# EAGLE design 234_sync_clock_divider (EAGLE 7.5.0)
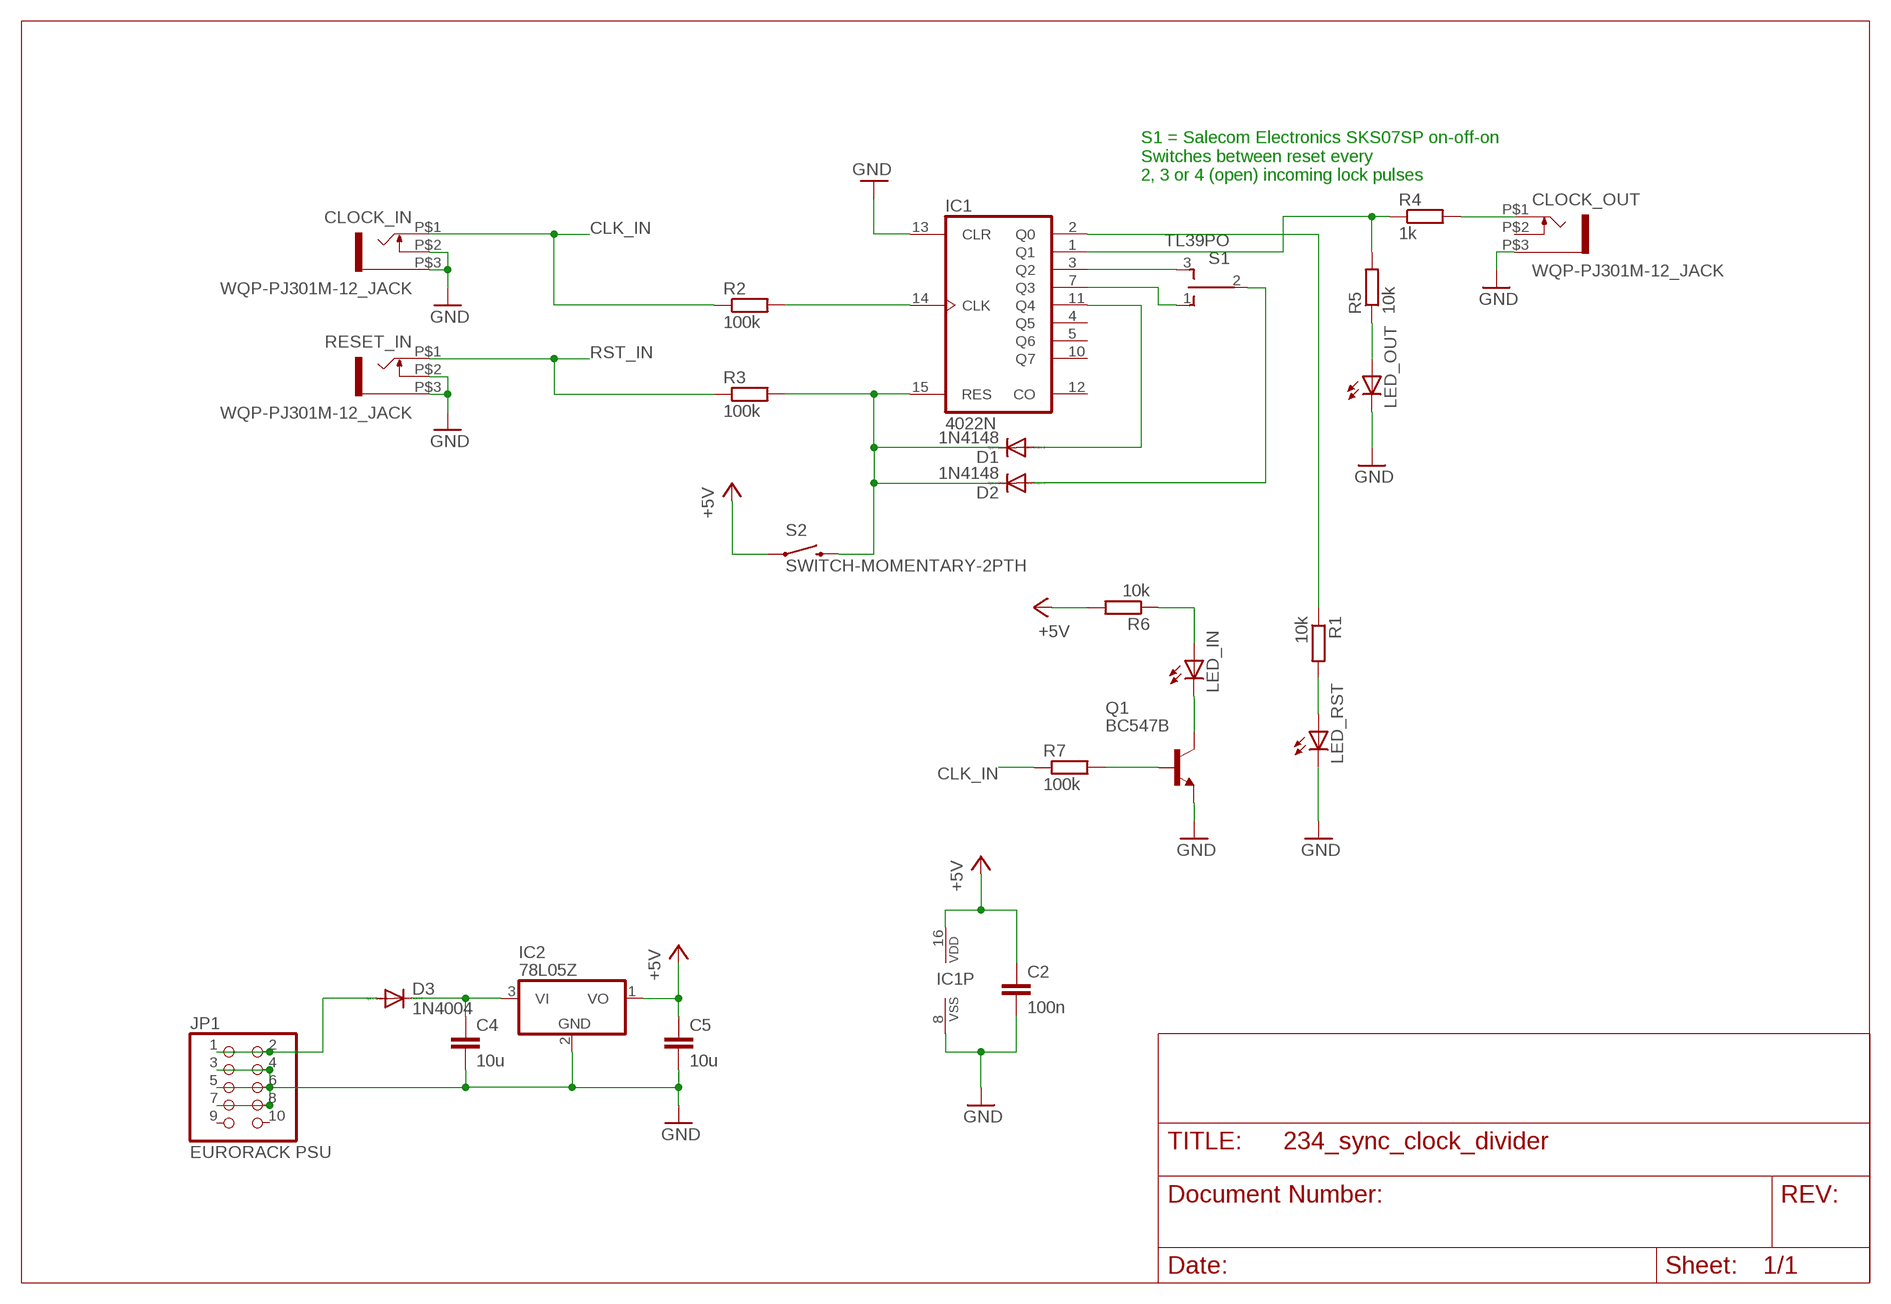
[diagram p0: schematic, sheet 1]

## Parts
C2  100n  C-EU025-025X050  [C025-025X050]
C4  10u  C-EUC1206K  [C1206K]
C5  10u  C-EUC1206K  [C1206K]
CLOCK_IN  WQP-PJ301M-12_JACK  [WQP-PJ301M-12_JACK]
CLOCK_OUT  WQP-PJ301M-12_JACK  [WQP-PJ301M-12_JACK]
D1  1N4148  DIODE-D-2.5  [D-2.5]
D2  1N4148  DIODE-D-2.5  [D-2.5]
D3  1N4004  DIODE-D-2.5  [D-2.5]
IC1  4022N  [DIL16]
IC2  78L05Z  [TO92]
JP1  EURORACK PSU  PINHD-2X5  [2X05]
LED_IN  LED3MM  [LED3MM]
LED_OUT  LED3MM  [LED3MM]
LED_RST  LED3MM  [LED3MM]
Q1  BC547B  [TO92]
R1  10k  R-EU_0204/2V  [0204V]
R2  100k  R-EU_0204/2V  [0204V]
R3  100k  R-EU_0204/2V  [0204V]
R4  1k  R-EU_0204/2V  [0204V]
R5  10k  R-EU_0204/2V  [0204V]
R6  10k  R-EU_0204/2V  [0204V]
R7  100k  R-EU_0204/2V  [0204V]
RESET_IN  WQP-PJ301M-12_JACK  [WQP-PJ301M-12_JACK]
S1  TL39PO  [TL3XPO]
S2  SWITCH-MOMENTARY-2PTH  [TACTILE-PTH]

## Nets
+5V: C2.1 C5.1 IC1.16(VDD) IC2.1(VO) R6.2 S2.1
+12V_IN: D3.A JP1.1 JP1.2
CLK_IN: CLOCK_IN.P$1 R2.1 R7.1
GND: C2.2 C4.2 C5.2 CLOCK_IN.P$2 CLOCK_IN.P$3 CLOCK_OUT.P$3 IC1.8(VSS) IC1.13(CLR) IC2.2(GND) JP1.3 JP1.4 JP1.5 JP1.6 JP1.7 JP1.8 LED_OUT.K(C) LED_RST.K(C) Q1.1(E) RESET_IN.P$2 RESET_IN.P$3
N$1: LED_RST.A R1.2
N$2: IC1.14(CLK) R2.2
N$3: D1.C D2.C IC1.15(RES) R3.2 S2.3
N$4: IC1.2(Q0) R1.1
N$7: IC1.1(Q1) R4.1 R5.2
N$8: CLOCK_OUT.P$1 R4.2
N$9: LED_OUT.A R5.1
N$10: D1.A IC1.11(Q4)
N$11: IC1.3(Q2) S1.3(S)
N$12: IC1.7(Q3) S1.1(O)
N$13: D2.A S1.2(P)
N$14: C4.1 D3.C IC2.3(VI)
N$16: LED_IN.A R6.1
N$17: LED_IN.K(C) Q1.3(C)
N$18: Q1.2(B) R7.2
RST_IN: R3.1 RESET_IN.P$1
Unconnected: CLOCK_OUT.P$2 IC1.4(Q5) IC1.5(Q6) IC1.10(Q7) IC1.12(CO) JP1.9 JP1.10

## Notes on the sheet
- S1 = Salecom Electronics SKS07SP on-off-on
  Switches between reset every
  2, 3 or 4 (open) incoming lock pulses

## Library data of the parts
C2 C4 C5 = rcl:C-EU: CAPACITOR, European symbol
CLOCK_IN CLOCK_OUT RESET_IN = thonkiconn:WQP-PJ301M-12_JACK
D1-D3 = diode:DIODE-: DIODE
IC1 = 40xx:4022: Divide-by 8 COUNTER
IC2 = linear:78*: Positive VOLTAGE REGULATOR Source: http://cache.national.com/ds/LM/LM78L05.pdf http://www.fairchildsemi.com/ds/LM/LM7805.pdf
JP1 = pinhead:PINHD-2X5: PIN HEADER
LED_IN LED_OUT LED_RST = led:LED: LED OSRAM: - CHIPLED LG R971, LG N971, LY N971, LG Q971, LY Q971, LO R971, LY R971 LH N974, LH R974 LS Q976, LO Q976, LY Q976 LO Q996 - Hyper CHIPLED LW Q18S LB Q993, LB Q99A, LB R99A - SideLED LS A670, LO A670, LY A670, LG A670, LP A670 LB A673, LV A673, LT A673, LW A673 LH A674 LY A675 LS A676, LA A676, LO A676, LY A676, LW A676 LS A679, LY A679, LG A679 - Hyper Micro SIDELED® LS Y876, LA Y876, LO Y876, LY Y876 LT Y87S - SmartLED LW L88C, LW L88S LB L89C, LB L89S, LG L890 LS L89K, LO L89K, LY L89K LS L896, LA L896, LO L896, LY L896 - TOPLED LS T670, LO T670, LY T670, LG T670, LP T670 LSG T670, LSP T670, LSY T670, LOP T670, LYG T670 LG T671, LOG T671, LSG T671 LB T673, LV T673, LT T673, LW T673 LH T674 LS T676, LA T676, LO T676, LY T676, LB T676, LH T676, LSB T676, LW T676 LB T67C, LV T67C, LT T67C, LS T67K, LO T67K, LY T67K, LW E67C LS E67B, LA E67B, LO E67B, LY E67B, LB E67C, LV E67C, LT E67C LW T67C LS T679, LY T679, LG T679 LS T770, LO T770, LY T770, LG T770, LP T770 LB T773, LV T773, LT T773, LW T773 LH T774 LS E675, LA E675, LY E675, LS T675 LS T776, LA T776, LO T776, LY T776, LB T776 LHGB T686 LT T68C, LB T68C - Hyper Mini TOPLED® LB M676 - Mini TOPLED Santana® LG M470 LS M47K, LO M47K, LY M47K Source: http://www.osram.convergy.de LUXEON: - LUMILED® LXK2-PW12-R00, LXK2-PW12-S00, LXK2-PW14-U00, LXK2-PW14-V00 LXK2-PM12-R00, LXK2-PM12-S00, LXK2-PM14-U00 LXK2-PE12-Q00, LXK2-PE12-R00, LXK2-PE12-S00, LXK2-PE14-T00, LXK2-PE14-U00 LXK2-PB12-K00, LXK2-PB12-L00, LXK2-PB12-M00, LXK2-PB14-N00, LXK2-PB14-P00, LXK2-PB14-Q00 LXK2-PR12-L00, LXK2-PR12-M00, LXK2-PR14-Q00, LXK2-PR14-R00 LXK2-PD12-Q00, LXK2-PD12-R00, LXK2-PD12-S00 LXK2-PH12-R00, LXK2-PH12-S00 LXK2-PL12-P00, LXK2-PL12-Q00, LXK2-PL12-R00 Source: www.luxeon.com KINGBRIGHT: KA-3528ASYC Source: www.kingbright.com
Q1 = transistor-npn:BC547*: NPN Transistor
R1-R7 = rcl:R-EU_: RESISTOR, European symbol
S1 = switch:TL39PO: TINY SWITCH ON OFF ON Source: http://www2.produktinfo.conrad.com/datenblaetter/700000-724999/705152-da-01-de-Subminiaturschalter_TL_36YO.pdf
S2 = SparkFun-Electromechanical:SWITCH-MOMENTARY-2: Various NO switches- pushbuttons, reed, etc; PROD_ID: SWCH-08441

## Board
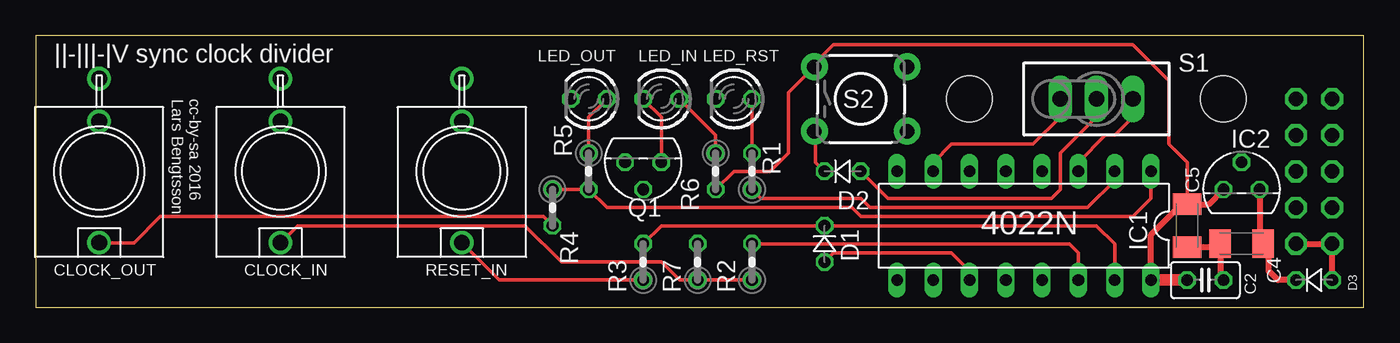
[diagram p1: board, top side]
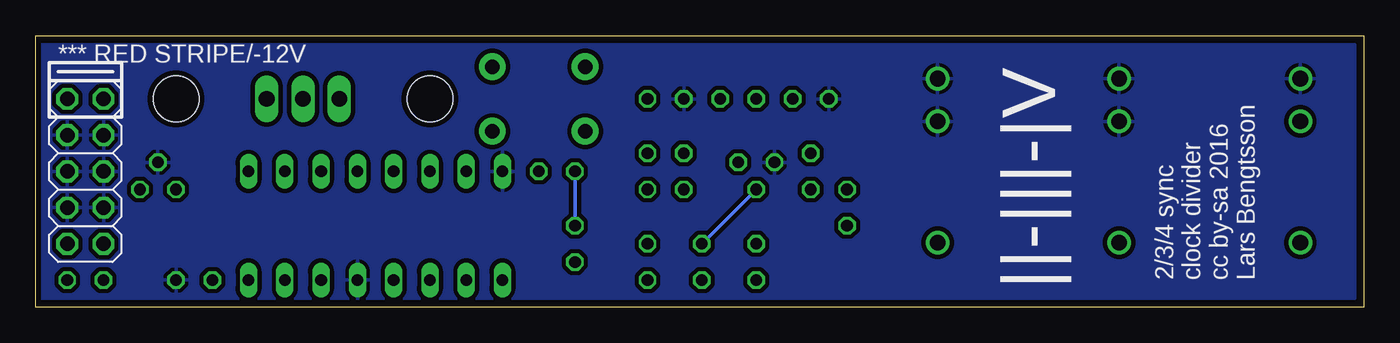
[diagram p2: board, bottom side, seen from below]

Size 93.02 x 19.04 mm. Coordinates in mm from the lower left corner, seen from the top.
Outline: 0,0 93.02,0 93.02,19.04 0,19.04 0,0
Copper layers (1*16): Top 0.0356mm / dielectric 1.5011mm / Bottom 0.0356mm
Design rules "LaenPCBOrder": minimum track width 6mil, minimum drill 13mil, track to track 6mil, track to pad 6mil, pad to pad 6mil, via to via 6mil, smd to smd 6mil, copper to edge 15mil, drill to drill 6mil, minimum pad ring 7mil, minimum via ring 7mil, stop-mask expansion 3mil, vias tented up to drill 0mil, thermal gap 10mil
Holes 3.2 mm at 65.41,14.61 83.19,14.61

### Footprints (pad centres in the part's own frame; a part is rotated, then mirrored left to right if it is on the bottom)
C025-025X050 = drill 0.813 octagon: 1 -1.27,0; 2 1.27,0
C1206K = smd 1.5 x 2: 1 -1.5,0; 2 1.5,0
WQP-PJ301M-12_JACK = drill 1.1: P$1 0,5; P$2 0,-3.5; P$3 0,-6.5
D-2.5 = drill 0.813 octagon: A 1.27,0; C -1.27,0
DIL16 = drill 0.813 long: 1 -8.89,-3.81; 2 -6.35,-3.81; 3 -3.81,-3.81; 4 -1.27,-3.81; 5 1.27,-3.81; 6 3.81,-3.81; 7 6.35,-3.81; 8 8.89,-3.81; 9 8.89,3.81; 10 6.35,3.81; 11 3.81,3.81; 12 1.27,3.81; 13 -1.27,3.81; 14 -3.81,3.81; 15 -6.35,3.81; 16 -8.89,3.81
TO92 = drill 0.813 octagon: 1 -1.27,0; 2 0,1.905; 3 1.27,0
2X05 = drill 1.016 octagon: 1 -5.08,-1.27; 2 -5.08,1.27; 3 -2.54,-1.27; 4 -2.54,1.27; 5 0,-1.27; 6 0,1.27; 7 2.54,-1.27; 8 2.54,1.27; 9 5.08,-1.27; 10 5.08,1.27
LED3MM = drill 0.813 octagon: A -1.27,0; K 1.27,0
TO92' = drill 0.813 octagon: 1 1.27,0; 2 0,1.905; 3 -1.27,0
0204V = drill 0.813 octagon: 1 -1.27,0; 2 1.27,0
TL3XPO = drill 1.1 pad 1.422 long: 1 -2.54,0; 2 0,0; 3 2.54,0
TACTILE-PTH = drill 1.016 pad 1.88: 1 -3.251,2.261; 2 3.251,2.261; 3 -3.251,-2.261; 4 3.251,-2.261

### Placement (x,y rotation side)
C2  81.92,1.91 0 top
C4  84.45,4.45 180 top
C5  80.64,5.72 270 top
CLOCK_IN  17.14,9.53 180 top
CLOCK_OUT  4.45,9.53 180 top
D1  55.25,4.45 270 top
D2  56.52,9.53 0 top
D3  89.53,1.91 0 top
IC1  69.22,5.72 180 top
IC2  84.45,8.26 0 top
JP1  89.53,9.53 90 bottom
LED_IN  43.82,14.61 180 top
LED_OUT  38.73,14.61 180 top
LED_RST  48.9,14.61 180 top
Q1  BC547B  [TO92']  42.55,10.16 180 top
R1  50.17,9.53 90 top
R2  50.17,3.18 90 top
R3  42.55,3.18 90 top
R4  36.2,6.99 270 top
R5  38.73,9.53 270 top
R6  47.62,9.53 270 top
R7  46.36,3.18 90 top
RESET_IN  29.85,9.53 180 top
S1  74.3,14.61 0 top
S2  57.79,14.61 0 top

### Tracks (layer width: path | path; a pad name or v marks a point on that pad's centre or on a via)
+5V
  Top 0.254: R6.2 48.9,9.53 51.44,9.53 52.71,10.8 52.71,15.04 S2.1 54.53,17.07 55.88,18.41 76.84,18.41 79.38,15.88 79.38,11.43 80.64,10.16 C5.1 80.64,6.99
  Top 0.406: C5.1 82.14,7.22 IC2.1 | IC1.16 78.11,5.08 80.01,6.99 80.64,6.99
  Top 0.813: IC1.16 C2.1
+12V_IN
  Top 0.406: JP1.1 JP1.2 D3.A
CLK_IN
  Top 0.254: CLOCK_IN.P$1 18.34,5.72 34.29,5.72 36.83,3.18 43.82,3.18 45.09,1.91 R7.1 R2.1
GND
  Top 0.406: C5.2 82.73,4.22 C4.2 82.95,2.14 C2.2
  pour Bottom (isolate 0.305): 0.64,18.41 92.71,18.41 92.71,0.64 0.64,0.64
N$1
  Top 0.254: LED_RST.A R1.2
N$2
  Top 0.254: IC1.14 73.03,3.81 72.39,4.45 R2.2
N$3
  Top 0.254: IC1.15 75.56,4.45 74.3,5.72 D1.C 43.82,5.72 R3.2 | D2.C 54.61,10.16 54.61,12.27 S2.3
  Bottom 0.254: D2.C D1.C
N$4
  Top 0.254: IC1.2 75.56,8.89 73.66,6.99 58.42,6.99 57.79,7.62 50.8,7.62 R1.1
N$7
  Top 0.254: R4.1 R5.2 40.01,6.99 57.15,6.99 57.79,6.35 76.84,6.35 78.11,7.62 IC1.1
N$8
  Top 0.254: CLOCK_OUT.P$1 6.91,4.53 8.73,6.35 35.56,6.35 R4.2
N$9
  Top 0.254: R5.1 38.73,13.34 LED_OUT.A
N$10
  Top 0.254: IC1.11 65.41,2.54 64.14,3.81 55.88,3.81 D1.A
N$11
  Top 0.254: S1.3 76.84,13.34 75.56,12.07 74.93,12.07 73.03,10.16 IC1.3
N$12
  Top 0.254: S1.1 71.76,13.34 69.85,11.43 64.14,11.43 62.87,10.16 IC1.7
N$13
  Top 0.254: S1.2 74.3,13.34 71.76,10.8 71.76,8.26 71.12,7.62 59.69,7.62 D2.A
N$14
  Top 0.406: D3.C 87,1.91 86.36,2.54 86.36,4.04 C4.1 85.73,4.68 IC2.3
N$16
  Top 0.254: R6.1 47.62,12.07 LED_IN.A
N$17
  Top 0.254: Q1.3 43.82,13.34 LED_IN.K
N$18
  Bottom 0.254: R7.2 Q1.2
RST_IN
  Top 0.254: RESET_IN.P$1 32.47,1.91 R3.1

### Text on the board
tPlace: ||-|||-|V sync clock divider | cc-by-sa 2016 / Lars Bengtsson
bPlace: *** RED STRIPE/-12V | 2/3/4 sync / clock divider / cc by-sa 2016 / Lars Bengtsson | ||-|||-|V